# Altium schematic sheet IMU.SchDoc
size B
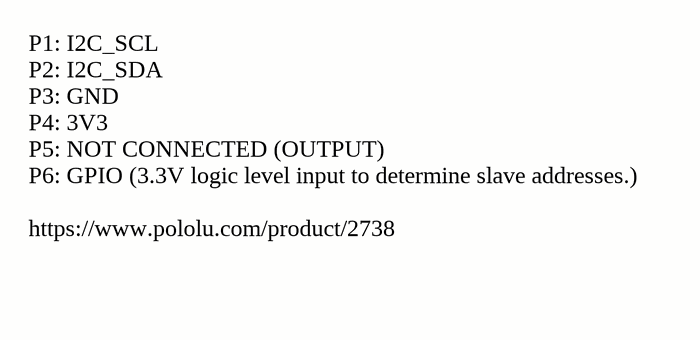
[diagram p0: IMU.SchDoc]

## Notes on the sheet
- P1: I2C_SCL
  P2: I2C_SDA
  P3: GND
  P4: 3V3
  P5: NOT CONNECTED (OUTPUT)
  P6: GPIO (3.3V logic level input to determine slave addresses.)
  https://www.pololu.com/product/2738